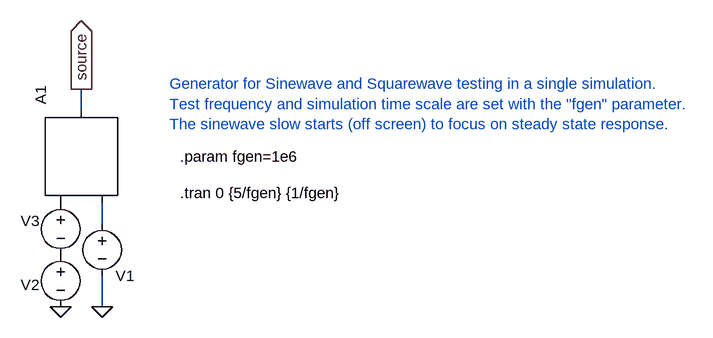
[diagram p0: schematic Sine_Square.asc]
Sine_Square.asc, the LTspice schematic file:
Version 4
SHEET 1 1348 932
WIRE 32 608 32 576
WIRE 64 784 64 752
WIRE 64 912 64 864
FLAG 64 912 0
FLAG 0 912 0
FLAG 32 576 source
IOPIN 32 576 Out
SYMBOL voltage 64 768 R0
WINDOW 123 0 0 Left 0
WINDOW 0 21 96 Left 0
WINDOW 3 21 112 Invisible 0
SYMATTR InstName V1
SYMATTR Value PULSE(0 1 0 {1/fgen} {1/fgen} {6.5/fgen} {1e6/fgen})
SYMATTR SpiceLine Rser=1m
SYMBOL voltage 0 816 M0
WINDOW 123 0 0 Left 0
WINDOW 0 32 62 Left 0
WINDOW 3 32 90 Invisible 0
SYMATTR InstName V2
SYMATTR Value PULSE(0.01 0 {3.25/fgen} {0.001/fgen} 0 10 20)
SYMATTR SpiceLine Rser=1m
SYMBOL voltage 0 736 M0
WINDOW 123 0 0 Left 0
WINDOW 0 32 43 Left 0
WINDOW 3 32 71 Invisible 0
SYMATTR InstName V3
SYMATTR Value PULSE(0 1 {3.5/fgen} {0.0001/fgen} {0.0001/fgen} {0.0049/fgen} {0.5/fgen})
SYMATTR SpiceLine Rser=1m
SYMBOL modulate 0 752 R270
WINDOW 3 -21 130 Invisible 0
SYMATTR Value mark={fgen*100} space=0
SYMATTR InstName A1
TEXT 184 680 Left 0 !.param fgen=1e6
TEXT 184 736 Left 0 !.tran 0 {5/fgen} {1/fgen}
TEXT 168 568 Left 0 ;Generator for Sinewave and Squarewave testing in a single simulation.\nTest frequency and simulation time scale are set with the "fgen" parameter.\nThe sinewave slow starts (off screen) to focus on steady state response.

The netlist it stands for:
* Sine_Square.asc
V1 N001 0 PULSE(0 1 0 {1/fgen} {1/fgen} {6.5/fgen} {1e6/fgen}) Rser=1m
V2 P001 0 PULSE(0.01 0 {3.25/fgen} {0.001/fgen} 0 10 20) Rser=1m
V3 P002 P001 PULSE(0 1 {3.5/fgen} {0.0001/fgen} {0.0001/fgen} {0.0049/fgen} {0.5/fgen}) Rser=1m
A1 P002 N001 0 0 0 0 source 0 MODULATOR mark={fgen*100} space=0
.param fgen=1e6
.tran 0 {5/fgen} {1/fgen}
* Generator for Sinewave and Squarewave testing in a single simulation.
* Test frequency and simulation time scale are set with the "fgen" parameter.
* The sinewave slow starts (off screen) to focus on steady state response.
.backanno
.end